# Altium schematic sheet WL-Power.SchDoc
size 420 x 297 mm; Address1: Address1; Address2: Address2; Address3: Address3; Address4: Address4; DocumentNumber: Wolf-Lite; SheetNumber: 8; Scale: 1:1; DocumentType: Схема электрическая принципиальная; FirstReferrence: UA3REO/R7KBI
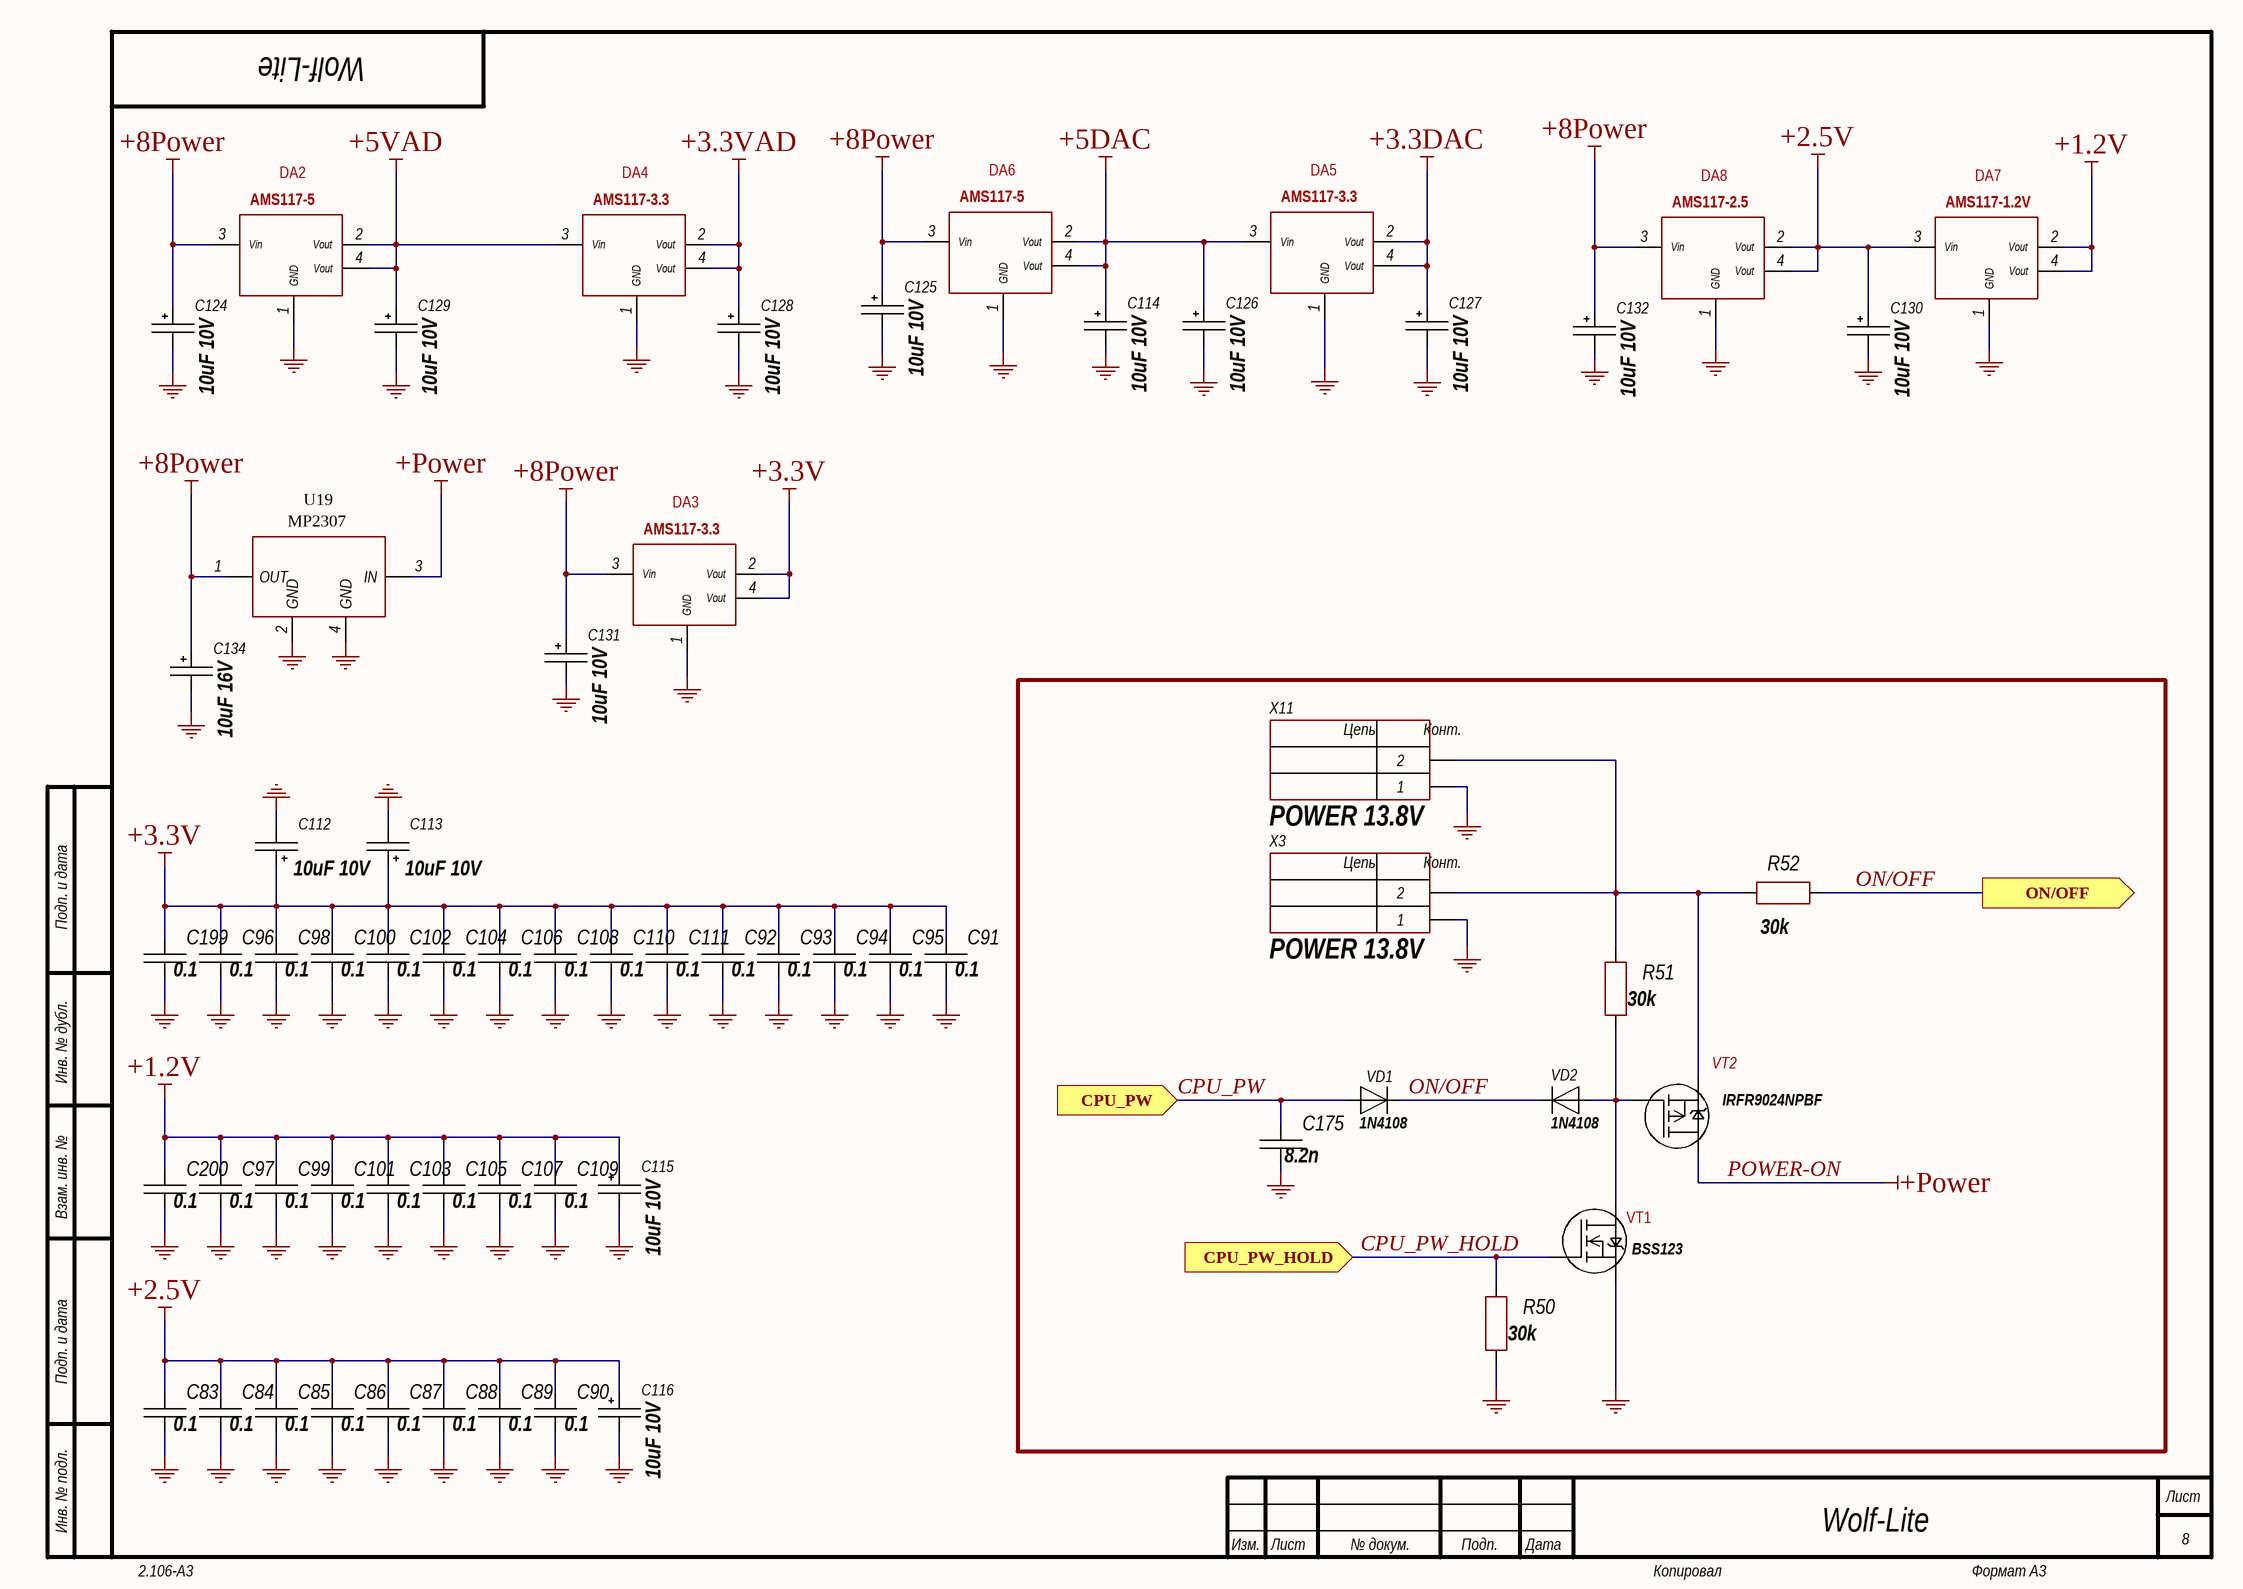
[diagram p0: WL-Power.SchDoc]

## Parts
C83  0.1  [CH0805C]
C84  0.1  [CH0805C]
C85  0.1  [CH0805C]
C86  0.1  [CH0805C]
C87  0.1  [CH0805C]
C88  0.1  [CH0805C]
C89  0.1  [CH0805C]
C90  0.1  [CH0805C]
C91  0.1  [CH0805C]
C92  0.1  [CH0805C]
C93  0.1  [CH0805C]
C94  0.1  [CH0805C]
C95  0.1  [CH0805C]
C96  0.1  [CH0805C]
C97  0.1  [CH0805C]
C98  0.1  [CH0805C]
C99  0.1  [CH0805C]
C100  0.1  [CH0805C]
C101  0.1  [CH0805C]
C102  0.1  [CH0805C]
C103  0.1  [CH0805C]
C104  0.1  [CH0805C]
C105  0.1  [CH0805C]
C106  0.1  [CH0805C]
C107  0.1  [CH0805C]
C108  0.1  [CH0805C]
C109  0.1  [CH0805C]
C110  0.1  [CH0805C]
C111  0.1  [CH0805C]
C112  10uF 10V  [TANTAL_B]
C113  10uF 10V  [TANTAL_B]
C114  10uF 10V  [TANTAL_B]
C115  10uF 10V  [TANTAL_B]
C116  10uF 10V  [TANTAL_B]
C124  10uF 10V  [TANTAL_B]
C125  10uF 10V  [TANTAL_B]
C126  10uF 10V  [TANTAL_B]
C127  10uF 10V  [TANTAL_B]
C128  10uF 10V  [TANTAL_B]
C129  10uF 10V  [TANTAL_B]
C130  10uF 10V  [TANTAL_B]
C131  10uF 10V  [TANTAL_B]
C132  10uF 10V  [TANTAL_B]
C134  10uF 16V  [POLIMER-D]
C175  8.2n  [CH0805C]
C199  0.1  [CH0805C]
C200  0.1  [CH0805C]
DA2  AMS117-5  [SOT223]
DA3  AMS117-3.3  [SOT223]
DA4  AMS117-3.3  [SOT223]
DA5  AMS117-3.3  [SOT223]
DA6  AMS117-5  [SOT223]
DA7  AMS117-1.2V  [SOT223]
DA8  AMS117-2.5  [SOT223]
R50  30k  [CH0805R]
R51  30k  [CH0805R]
R52  30k  [CH0805R]
U19  MP2307  [MP2307 MINI360]
VD1  1N4108  [1N4148]
VD2  1N4108  [1N4148]
VT1  BSS123  [SOT23_132]
VT2  IRFR9024NPBF  [D2PAK_132]
X3  POWER 13.8V  [CON: 300-02P-5.0]
X11  POWER 13.8V  [CON: 300-02P-5.0]

## Ports
CPU_PW (in), CPU_PW_HOLD (in), ON/OFF (out)

## Nets
+1.2V: C97.1 C99.1 C101.1 C103.1 C105.1 C107.1 C109.1 C115.1 C200.1 DA7.2(Vout) DA7.4(Vout)
+2.5V: C83.1 C84.1 C85.1 C86.1 C87.1 C88.1 C89.1 C90.1 C116.1 C130.1 DA7.3(Vin) DA8.2(Vout) DA8.4(Vout)
+3.3DAC: C127.1 DA5.2(Vout) DA5.4(Vout)
+3.3V: C91.1 C92.1 C93.1 C94.1 C95.1 C96.1 C98.1 C100.1 C102.1 C104.1 C106.1 C108.1 C110.1 C111.1 C112.1 C113.1 C199.1 DA3.2(Vout) DA3.4(Vout)
+3.3VAD: C128.1 DA4.2(Vout) DA4.4(Vout)
+5DAC: C114.1 C126.1 DA5.3(Vin) DA6.2(Vout) DA6.4(Vout)
+5VAD: C129.1 DA2.2(Vout) DA2.4(Vout) DA4.3(Vin)
+8Power: C124.1 C125.1 C131.1 C132.1 C134.1 DA2.3(Vin) DA3.3(Vin) DA6.3(Vin) DA8.3(Vin) U19.1(OUT)
GND: C83.2 C84.2 C85.2 C86.2 C87.2 C88.2 C89.2 C90.2 C91.2 C92.2 C93.2 C94.2 C95.2 C96.2 C97.2 C98.2 C99.2 C100.2 C101.2 C102.2 C103.2 C104.2 C105.2 C106.2 C107.2 C108.2 C109.2 C110.2 C111.2 C112.2 C113.2 C114.2 C115.2 C116.2 C124.2 C125.2 C126.2 C127.2 C128.2 C129.2 C130.2 C131.2 C132.2 C134.2 C175.2 C199.2 C200.2 DA2.1(GND) DA3.1(GND) DA4.1(GND) DA5.1(GND) DA6.1(GND) DA7.1(GND) DA8.1(GND) R50.1 U19.2(GND) U19.4(GND) VT1.2(I) X3.1 X11.1
POWER-ON: U19.3(IN) VT2.3(D)  [also labelled +Power]
CPU_PW: C175.1 VD1.1 ; port CPU_PW
CPU_PW_HOLD: R50.2 VT1.1(Затвор(Gate)) ; port CPU_PW_HOLD
ON/OFF: R52.1 VD1.2 VD2.2 ; port ON/OFF
NetR51_1: R51.1 VD2.1 VT1.3(Сток(Drain)) VT2.1(Затвор(Gate))
NetR51_2: R51.2 R52.2 VT2.2(S) X3.2 X11.2

## Notes on the sheet
- Подп. и дата
- Инв. № дубл.
- Взам. инв. №
- Инв. № подл.
- Изм.
- Лист
- № докум.
- Подп.
- Дата
- 2.106-A3
- Копировал
- Формат А3
- (in symbol 2-Connector) Цепь; Конт.

## Library data of the parts
C83-C111 C175 C199 C200 = Capacitor: Manufacturer: *; Model: *; HelpURL: *; ComponentKind: *; Value: *
C112-C116 C124-C132 C134 = TantalCap: Manufacturer: *; Model: *; HelpURL: *; ComponentKind: *; Value: *
DA2-DA8 = AMS117
R50-R52 = Resistor: Manufacturer: *; Model: *; HelpURL: *; ComponentKind: *; Value: *
VD1 VD2 = Diod: ComponentKind: *; Manufacturer: *; Model: *; HelpURL: *
VT1 = N-KANAL
VT2 = P-KANAL
X3 X11 = 2-Connector: Model: *; Manufacturer: *; HelpURL: *; ComponentKind: *